# EAGLE design tricorder-teensy-mk-1.11 (EAGLE 9.3.1)
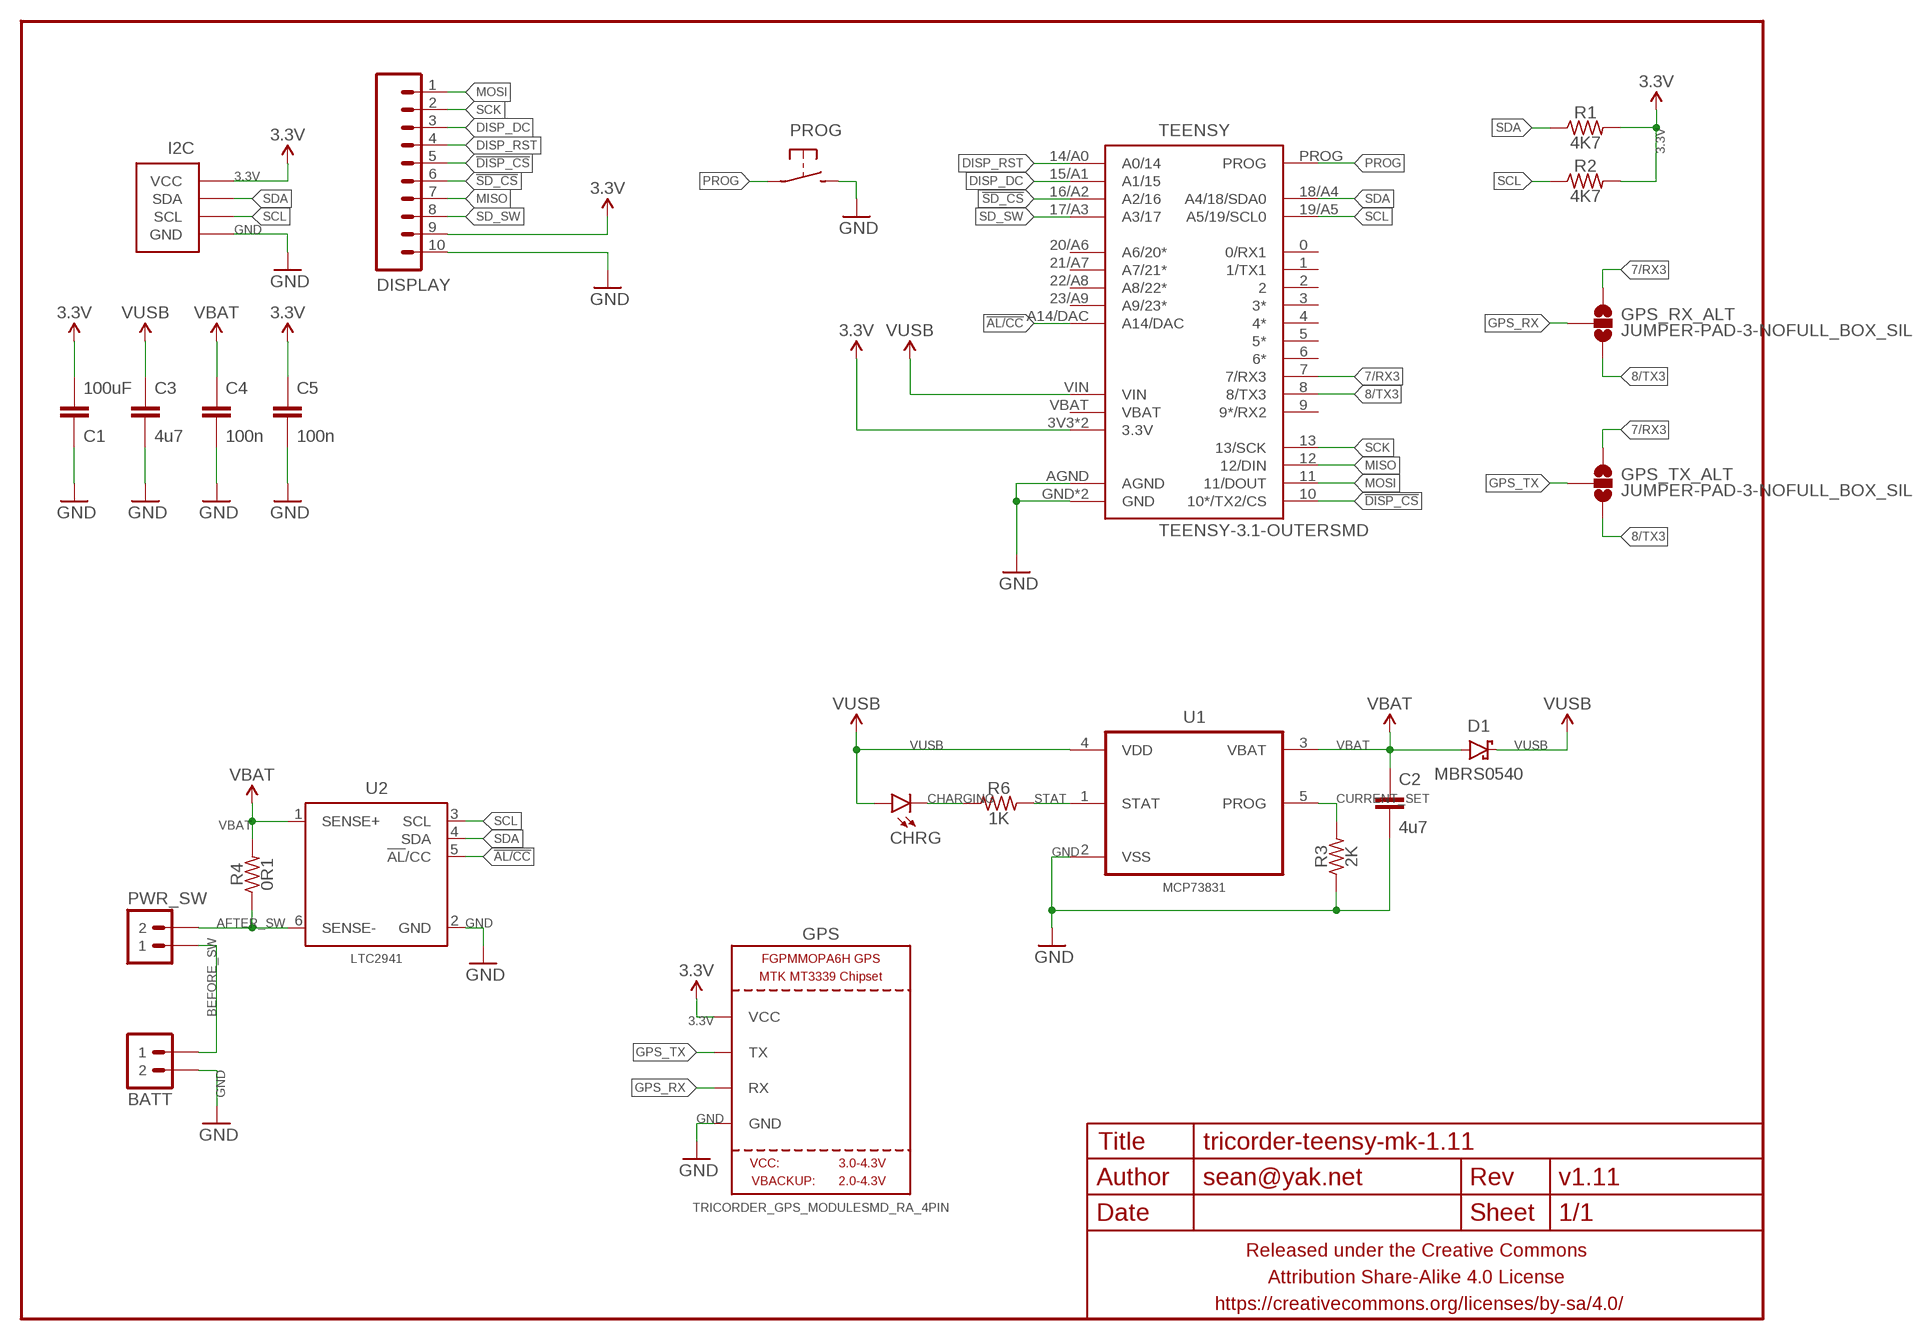
[diagram p0: schematic, sheet 1]

## Parts
BATT  M02JST-2MM-SMT  [JST-2-SMD]
C1  100uF  CAPACITOR-CERAMICC1210  [C1210]
C2  4u7  CAPACITOR-CERAMICC0603-TIGHTER  [C0603-TIGHTER]
C3  4u7  CAPACITOR-CERAMICC0603-TIGHTER  [C0603-TIGHTER]
C4  100n  CAPACITOR-CERAMICC0603-TIGHTER  [C0603-TIGHTER]
C5  100n  CAPACITOR-CERAMICC0603-TIGHTER  [C0603-TIGHTER]
CHRG  LED0603-TIGHT  [LED-0603-TIGHT]
D1  MBRS0540  DIODE-SCHOTTKYSOD123  [SOD123-SCHOTTKY]
DISPLAY  M10SMD_RA_2MM  [1X10_SMD_RA_MALE]
FRAME1  FRAME-LETTERNO_PACKAGE  [DUMMY]
GPS  TRICORDER_GPS_MODULESMD_RA_4PIN  [TRICORDER_GPS_MODULE_RA_CONN_SMD_4PIN]
GPS_RX_ALT  JUMPER-PAD-3-NOFULL_BOX_SILK  [PAD-JUMPER-3-NO_YES_SILK_FULL_BOX]
GPS_TX_ALT  JUMPER-PAD-3-NOFULL_BOX_SILK  [PAD-JUMPER-3-NO_YES_SILK_FULL_BOX]
I2C  M04-I2CSMD_2MM_RA  [1X04_SMD_RA_2MM_I2C]
PROG  SPST-NO-TACTCK-PTS840-GK  [TACTILE-SMD-CK-PTS840-GK]
PWR_SW  M02JST-2MM-SMT  [JST-2-SMD]
R1  4K7  RESISTORR0603-TIGHTER  [R0603-TIGHTER]
R2  4K7  RESISTORR0603-TIGHTER  [R0603-TIGHTER]
R3  2K  RESISTORR0603-TIGHTER  [R0603-TIGHTER]
R4  0R1  RESISTORR0805-TIGHTER  [R0805-TIGHTER]
R6  1K  RESISTORR0603-TIGHTER  [R0603-TIGHTER]
TEENSY  TEENSY-3.1-OUTERSMD  [TEENSY-3.1_SMT_BOTTOM_OUTERONLY]
U1  MCP73831  MCP73831T-2ACI/OT  [SOT95P280X145-5N]
U2  LTC2941  LTC2941/2DCB  [DFN200X300X50-7N]

## Nets
3.3V: C1.2 C5.1 DISPLAY.9 GPS.VCC I2C.VCC R1.2 R2.2 TEENSY.3V3(3.3V) TEENSY.3V3@1(3.3V)
7/RX3: GPS_RX_ALT.1 GPS_TX_ALT.1 TEENSY.7(7/RX3)
8/TX3: GPS_RX_ALT.3 GPS_TX_ALT.3 TEENSY.8(8/TX3)
!AL/CC: TEENSY.A14/DAC U2.5(!AL!/CC)
!DISP_CS: DISPLAY.5 TEENSY.10(10*/TX2/CS)
!SD_CS: DISPLAY.6 TEENSY.16/A2(A2/16)
AFTER_SW: PWR_SW.1 R4.1 U2.6(SENSE-)
BEFORE_SW: BATT.2 PWR_SW.2
CHARGING: CHRG.C R6.1
CURRENT_SET: R3.2 U1.5(PROG)
DISP_DC: DISPLAY.3 TEENSY.15/A1(A1/15)
DISP_RST: DISPLAY.4 TEENSY.14/A0(A0/14)
GND: BATT.1 C1.1 C2.2 C3.2 C4.2 C5.2 DISPLAY.10 GPS.GND I2C.GND PROG.3 PROG.4 R3.1 TEENSY.AGND TEENSY.GND TEENSY.GND@1(GND) U1.2(VSS) U2.2(GND)
GPS_RX: GPS.RX GPS_RX_ALT.2
GPS_TX: GPS.TX GPS_TX_ALT.2
MISO: DISPLAY.7 TEENSY.12(12/DIN)
MOSI: DISPLAY.1 TEENSY.11(11/DOUT)
PROG: PROG.1 PROG.2 TEENSY.PROG
SCK: DISPLAY.2 TEENSY.13(13/SCK)
SCL: I2C.SCL R2.1 TEENSY.19/A5(A5/19/SCL0) U2.3(SCL)
SD_SW: DISPLAY.8 TEENSY.17/A3(A3/17)
SDA: I2C.SDA R1.1 TEENSY.18/A4(A4/18/SDA0) U2.4(SDA)
STAT: R6.2 U1.1(STAT)
VBAT: C2.1 C4.1 D1.A R4.2 U1.3(VBAT) U2.1(SENSE+)
VUSB: C3.1 CHRG.A D1.C TEENSY.VIN U1.4(VDD)
Unconnected: TEENSY.0(0/RX1) TEENSY.1(1/TX1) TEENSY.2 TEENSY.3(3*) TEENSY.4(4*) TEENSY.5(5*) TEENSY.6(6*) TEENSY.9(9*/RX2) TEENSY.20/A6(A6/20*) TEENSY.21/A7(A7/21*) TEENSY.22/A8(A8/22*) TEENSY.23/A9(A9/23*) TEENSY.VBAT

## Library data of the parts
BATT PWR_SW = a_parts:M02: Standard 2-pin 0.1" header. Use with - straight break away headers ( PRT-00116) - right angle break away headers (PRT-00553) - swiss pins (PRT-00743) - machine pins (PRT-00117) - female headers (PRT-00115) Molex polarized connector foot print use with: PRT-08233 with associated crimp pins and housings. 2.54_SCREWTERM for use with PRT-10571. 3.5mm Screw Terminal footprints for PRT-08084 5mm Screw Terminal footprints for use with PRT-08433; PROD_ID: CONN-08352
C1-C5 = a_parts:CAPACITOR-CERAMIC: CAPACITOR, European symbol
CHRG = a_parts:LED: LEDs Standard schematic elements and footprints for 5mm, 3mm, 1206, and 0603 sized LEDs. 5mm - Spark Fun Electronics SKU : COM-00529 (and others)
D1 = a_parts:DIODE-SCHOTTKY: Schottky diodes in SFE's production catalog BAT20J 1A 23V 0.62Vf RB751 120mA 40V 0.37Vf PMEG4005EJ 0.5A 40V 0.42Vf MBRA140 1A 40V 0.5Vf B340A 3A 40V SMA
DISPLAY = a_parts:M10: Header 10 Standard 10-pin 0.1" header. Use with straight break away headers (SKU : PRT-00116), right angle break away headers (PRT-00553), swiss pins (PRT-00743), machine pins (PRT-00117), and female headers (PRT-00115).
FRAME1 = a_parts:FRAME-LETTER: Schematic Frame Standard 8.5x11 US Letter frame; DESIGNER: sean@yak.net; VERSION: v1.11
GPS = a_parts:TRICORDER_GPS_MODULE
GPS_RX_ALT GPS_TX_ALT = a_parts:JUMPER-PAD-3-NO
I2C = a_parts:M04-I2C
PROG = a_parts:SPST-NO-TACT
R1-R4 R6 = a_parts:RESISTOR: RESISTOR, American symbol
TEENSY = a_parts:TEENSY-3.1-OUTER
U1 = a_parts:MCP73831T-2ACI/OT: Charge Management Controller; MPN: MCP73831T-2ACI/OT; OC_FARNELL: 1332158; OC_NEWARK: 56K7045; PACKAGE: SOT-5; SUPPLIER: Microchip
U2 = a_parts:LTC2941/2

## Board
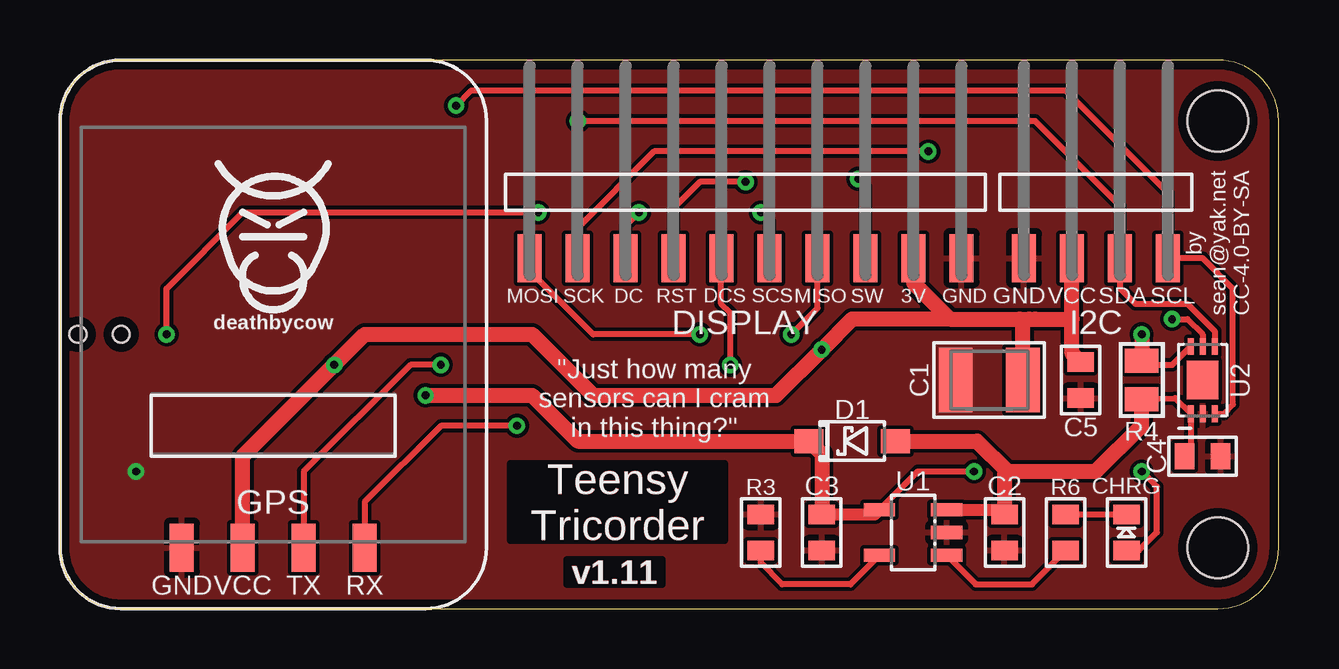
[diagram p1: board, top side]
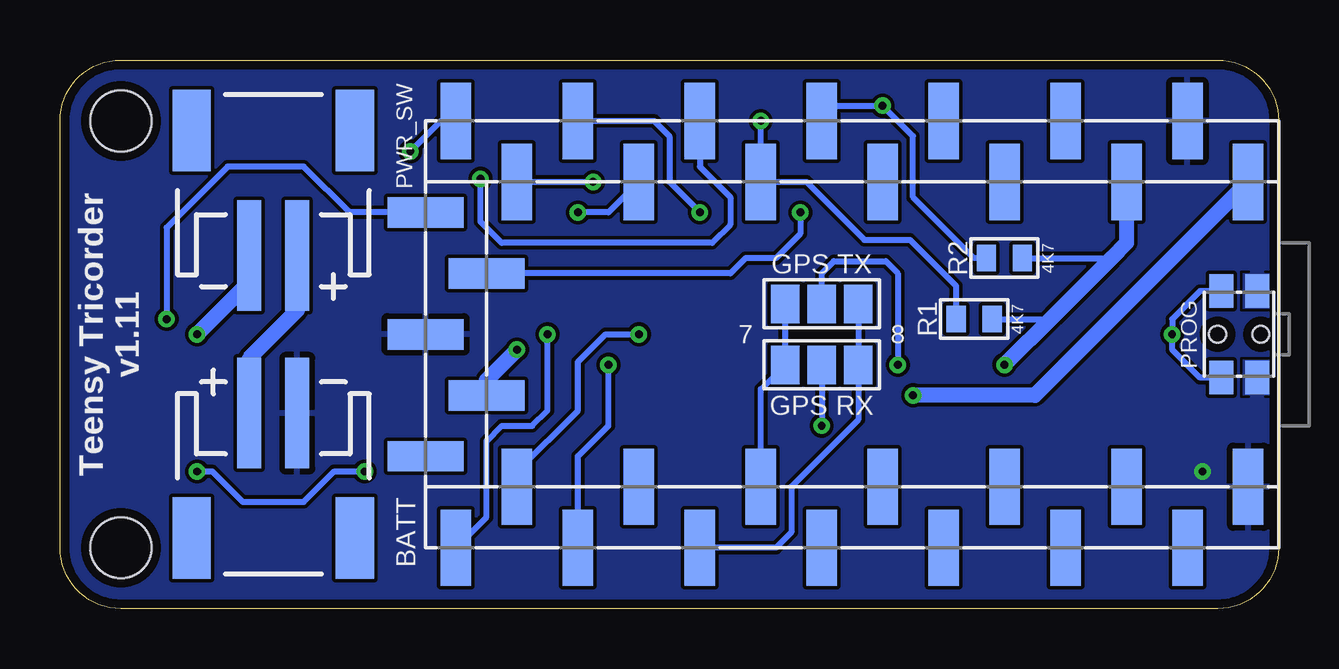
[diagram p2: board, bottom side, seen from below]

Size 50.8 x 22.86 mm. Coordinates in mm from the lower left corner, seen from the top.
Outline: 48.26,22.86 2.54,22.86 arc90 0,20.32 0,2.54 arc90 2.54,0 48.26,0 arc90 50.8,2.54 50.8,20.32 arc90 48.26,22.86
Copper layers (1*16): Top 0.0356mm / dielectric 1.5011mm / Bottom 0.0356mm
Design rules "LaenPCBOrder2": minimum track width 6mil, minimum drill 13mil, track to track 6mil, track to pad 6mil, pad to pad 6mil, via to via 6mil, smd to smd 6mil, copper to edge 15mil, drill to drill 6mil, minimum pad ring 7mil, minimum via ring 7mil, stop-mask expansion 3mil, vias tented up to drill 20mil, thermal gap 10mil
Holes 2.54 mm at 48.26,20.32 48.26,2.54

### Footprints (pad centres in the part's own frame; a part is rotated, then mirrored left to right if it is on the bottom)
JST-2-SMD = smd 1 x 4.6: 1 -1,-3.7; 2 1,-3.7 | smd 1.6 x 3.4: NC1 -3.4,1.5; NC2 3.4,1.5
C1210 = smd 1.4 x 2.7: 1 -1.4,0; 2 1.4,0
C0603-TIGHTER = smd 0.8 x 1.1: 1 -0.75,0; 2 0.75,0
LED-0603-TIGHT = smd 0.8 x 1.1: A 0.75,0; C -0.75,0
SOD123-SCHOTTKY = smd 1.2 x 1: A -1.8,0; C 1.8,0
1X10_SMD_RA_MALE = smd 1 x 2: 1 -9,0; 2 -7,0; 3 -5,0; 4 -3,0; 5 -1,0; 6 1,0; 7 3,0; 8 5,0; 9 7,0; 10 9,0
TRICORDER_GPS_MODULE_RA_CONN_SMD_4PIN = smd 1 x 2: GND 3.81,8.89; RX -3.81,8.89; TX -1.27,8.89; VCC 1.27,8.89
PAD-JUMPER-3-NO_YES_SILK_FULL_BOX = smd 1.2 x 1.6: 1 -1.524,0; 2 0,0; 3 1.524,0
1X04_SMD_RA_2MM_I2C = smd 1 x 2: GND -3,0; SCL 3,0; SDA 1,0; VCC -1,0
TACTILE-SMD-CK-PTS840-GK = smd 1.4 x 1: 1 -1.8,0.75; 2 1.8,0.75; 3 -1.8,-0.75; 4 1.8,-0.75 | hole 0.7: 0,-0.9; 0,0.9
R0603-TIGHTER = smd 0.8 x 1.1: 1 -0.75,0; 2 0.75,0
R0805-TIGHTER = smd 1 x 1.4: 1 -0.8,0; 2 0.8,0
TEENSY-3.1_SMT_BOTTOM_OUTERONLY = smd 3.175 x 1.27 bottom: 0 8.89,-13.97; 1 6.35,-11.43; 2 8.89,-8.89; 3 6.35,-6.35; 3V3@1 -6.35,-11.43; 4 8.89,-3.81; 5 6.35,-1.27; 6 8.89,1.27; 7 6.35,3.81; 8 8.89,6.35; 9 6.35,8.89; 10 8.89,11.43; 11 6.35,13.97; 12 8.89,16.51; 13 -8.89,16.51; 14/A0 -6.35,13.97; 15/A1 -8.89,11.43; 16/A2 -6.35,8.89; 17/A3 -8.89,6.35; 18/A4 -6.35,3.81; 19/A5 -8.89,1.27; 20/A6 -6.35,-1.27; 21/A7 -8.89,-3.81; 22/A8 -6.35,-6.35; 23/A9 -8.89,-8.89; AGND -8.89,-13.97; GND 6.35,-16.51; VIN -6.35,-16.51 | smd 1.27 x 3.175 bottom: 3V3 2.54,15.24; A14/DAC -5.08,17.78; GND@1 0,17.78; PROG -2.54,15.24; VBAT 5.08,17.78
SOT95P280X145-5N = smd 1.3 x 0.55: 1 -1.4,0.95; 2 -1.4,0; 3 -1.4,-0.95; 4 1.4,-0.95; 5 1.4,0.95
DFN200X300X50-7N = smd 0.25 x 0.7: 1 -0.5,-1.4; 2 0,-1.4; 3 0.5,-1.4; 4 0.5,1.4; 5 0,1.4; 6 -0.5,1.4 | smd 1.3 x 1.6: PAD 0,0

### Placement (x,y rotation side)
BATT  41.91,4.45 180 bottom
C1  38.73,9.53 0 top
C2  39.37,3.17 270 top
C3  31.75,3.17 270 top
C4  47.62,6.35 0 top
C5  42.55,9.53 270 top
CHRG  44.45,3.17 270 top
D1  33.02,6.99 180 top
DISPLAY  28.57,14.61 0 top
FRAME1  0,0 0 top
GPS  8.89,11.43 180 top
GPS_RX_ALT  19.05,10.16 0 bottom
GPS_TX_ALT  19.05,12.7 0 bottom
I2C  43.18,14.61 0 top
PROG  1.65,11.43 90 bottom
PWR_SW  41.91,18.41 0 bottom
R1  12.7,12.06 0 bottom
R2  11.43,14.61 0 bottom
R3  29.21,3.17 270 top
R4  45.09,9.53 270 top
R6  41.91,3.17 270 top
TEENSY  17.78,11.43 270 top
U1  35.56,3.17 180 top
U2  47.62,9.53 0 top
U$1  [COW_SMALL]  8.89,16 0 top

### Tracks (layer width: path | path; a pad name or v marks a point on that pad's centre or on a via)
3.3V  (via drill 0.33)
  Top 0.635: GPS.VCC 7.62,6.35 v11.43,10.16 12.7,11.43 19.68,11.43 22.23,8.89 29.84,8.89 v31.75,10.79 33.02,12.06 37.08,12.06 | DISPLAY.9 35.58,13.57 37.08,12.06 | 37.08,12.06 37.09,12.06 40.01,12.06 | 42.16,14.59 I2C.VCC 42.18,12.06 | 40.01,12.06 40.39,12.06 | 40.64,12.06 40.39,12.06 | C1.2 40.13,11.93 40.01,12.06 | C5.1 42.18,10.64 42.18,12.06 | 40.39,12.06 42.18,12.06
  Bottom 0.254: R1.2 9.53,12.06 9.4,12.19 | R2.2 6.99,14.61
  Bottom 0.635: TEENSY.3V3@1 6.35,15.24 6.99,14.61 9.4,12.19 v11.43,10.16 | TEENSY.3V3 33.02,9.53 v31.75,10.79
7/RX3
  Bottom 0.254: GPS_TX_ALT.1 GPS_RX_ALT.1 21.59,9.14 TEENSY.7
8/TX3
  Bottom 0.254: GPS_TX_ALT.3 GPS_RX_ALT.3 17.53,7.87 20.32,5.08 20.32,3.17 20.95,2.54 TEENSY.8
!AL/CC  (via drill 0.33)
  Top 0.254: v46.35,12.06 46.99,12.06 47.62,11.43 U2.5
  Bottom 0.254: TEENSY.A14/DAC 38.73,16.51 40.64,18.41 43.81,18.41 46.36,15.87 v46.35,12.06
!DISP_CS  (via drill 0.33)
  Top 0.254: v27.94,10.16 27.94,12.32 27.56,12.7 27.56,14.59 DISPLAY.5
  Bottom 0.254: TEENSY.10 29.21,6.35 27.94,7.62 v27.94,10.16
!SD_CS  (via drill 0.33)
  Top 0.254: v29.21,16.51 29.57,16.14 DISPLAY.6
  Bottom 0.254: TEENSY.16/A2 27.94,16.51 v29.21,16.51
AFTER_SW  (via drill 0.33)
  Top 0.254: R4.1 45.2,10.16 46.36,10.16 U2.6
  Top 0.635: v45.09,11.43 R4.1
  Bottom 0.635: PWR_SW.1 42.91,13.61 v45.09,11.43
BEFORE_SW
  Bottom 0.635: PWR_SW.2 40.91,12.43 42.91,10.43 BATT.2
CHARGING
  Top 0.254: R6.1 CHRG.C
CURRENT_SET
  Top 0.254: U1.5 32.95,1.02 30.1,1.02 29.21,1.91 R3.2
DISP_DC  (via drill 0.33)
  Top 0.254: v24.13,16.51 23.57,15.96 DISPLAY.3
  Bottom 0.254: TEENSY.15/A1 26.04,20.32 25.4,19.68 25.4,17.78 v24.13,16.51
DISP_RST  (via drill 0.33)
  Top 0.254: v28.57,17.78 26.67,17.78 25.57,16.68 DISPLAY.4
  Bottom 0.254: TEENSY.14/A0 v28.57,17.78
GND  (via drill 0.33)
  other vias: 3.17,5.71
  pour Bottom: 48.26,22.86 2.54,22.86 arc90 0,20.32 0,2.54 arc90 2.54,0 48.26,0 arc90 50.8,2.54 50.8,20.32 arc90
  pour Top: 48.26,22.86 2.54,22.86 arc90 0,20.32 0,2.54 arc90 2.54,0 48.26,0 arc90 50.8,2.54 50.8,20.32 arc90
GPS_RX  (via drill 0.33)
  Top 0.254: v19.05,7.62 15.88,7.62 12.7,4.45 GPS.RX
  Bottom 0.254: GPS_RX_ALT.2 v19.05,7.62
GPS_TX  (via drill 0.33)
  Top 0.254: GPS.TX 10.16,5.71 14.61,10.16 v15.88,10.16
  Bottom 0.254: GPS_TX_ALT.2 19.05,13.97 18.54,14.48 16.38,14.48 15.88,13.97 v15.88,10.16
MISO  (via drill 0.33)
  Top 0.254: v30.48,11.43 31.57,12.53 DISPLAY.7
  Bottom 0.254: TEENSY.12 33.02,3.81 33.02,6.99 32.38,7.62 31.11,7.62 30.48,8.26 v30.48,11.43
MOSI  (via drill 0.33)
  Top 0.254: v26.67,11.43 22.23,11.43 19.56,14.1 19.56,14.59 DISPLAY.1
  Bottom 0.254: v26.67,11.43 28.07,11.43 29.21,10.29 29.21,8.26 31.75,5.71 TEENSY.11
PROG  (via drill 0.33)
  Top 0.254: v4.45,11.43 4.45,13.34 7.62,16.51 v19.94,16.51
  Bottom 0.254: PROG.1 3.28,9.63 4.45,10.79 v4.45,11.43 4.45,12.06 3.28,13.23 PROG.2 | v19.94,16.51 19.94,15.62 20.95,14.61 22.23,14.61 22.86,13.97 TEENSY.PROG
SCK  (via drill 0.33)
  Top 0.254: v36.2,19.05 24.77,19.05 21.59,15.88 21.59,14.62 DISPLAY.2
  Bottom 0.254: TEENSY.13 34.92,20.32 v36.2,19.05
SCL  (via drill 0.33)
  Top 0.254: v16.51,20.95 17.14,21.59 41.91,21.59 46.18,17.32 I2C.SCL 47.62,14.61 48.9,13.34 48.9,8.51 48.51,8.12 U2.3
  Bottom 0.254: R2.1 12.7,14.61 15.24,17.14 15.24,19.68 v16.51,20.95 18.41,20.95 TEENSY.19/A5
SD_SW  (via drill 0.33)
  Top 0.254: DISPLAY.8 33.58,17.61 v33.27,17.91
  Bottom 0.254: TEENSY.17/A3 24.13,18.41 22.86,17.14 22.86,16 23.62,15.24 32.38,15.24 33.27,16.13 v33.27,17.91
SDA  (via drill 0.33)
  Top 0.254: v21.59,20.32 40.64,20.32 44.18,16.78 I2C.SDA 44.2,14.59 44.2,13.34 44.83,12.7 46.99,12.7 48.12,11.56 U2.4
  Bottom 0.254: v21.59,20.32 TEENSY.18/A4 19.68,17.78 17.27,15.37 15.37,15.37 13.45,13.45 R1.1
STAT
  Top 0.254: U1.1 38.17,1.02 40.51,1.02 R6.2
VBAT
  Top 0.254: R4.2 46.48,8.78 U2.1 47.12,6.6 C4.1
  Top 0.508: U1.3 39.17,4.12 C2.1
  Top 0.635: D1.A 38.23,6.99 39.5,5.71 | 39.5,5.71 39.37,5.71 C2.1 | 39.5,5.71 43.18,5.71 45.09,7.62 R4.2
VUSB  (via drill 0.33)
  Top 0.254: CHRG.A 44.97,2.42 45.72,3.17 45.72,5.08 v45.09,5.71 | U1.4 35.75,5.71 v38.1,5.71
  Top 0.508: C3.1 33.96,3.92 U1.4
  Top 0.635: v15.24,8.89 19.68,8.89 21.59,6.99 D1.C 31.75,6.46 C3.1
  Bottom 0.254: v45.09,5.71 44.45,5.71 43.18,4.45 40.64,4.45 39.37,5.71 v38.1,5.71
  Bottom 0.635: TEENSY.VIN 10.16,8.89 v15.24,8.89

### Text on the board
Top: Teensy / Tricorder
tPlace: by / sean@yak.net / CC-4.0-BY-SA | MOSI | SCK | DC | RST | DCS | SCS | MISO | SW | 3V | GND | "Just how many / sensors can I cram / in this thing?" | Teensy / Tricorder
bPlace: GPS TX | 8 | 7 | Teensy Tricorder | GPS RX